# Altium schematic sheet DDR4.SchDoc: =ProjectTitle
size A3; Author: Jaime I. Chait; Organization: NWES LLC; Address1: 111 SW 5th Ave, STE 3150; Address2: Portland, OR 97204; SheetNumber: 12; SheetTotal: 19
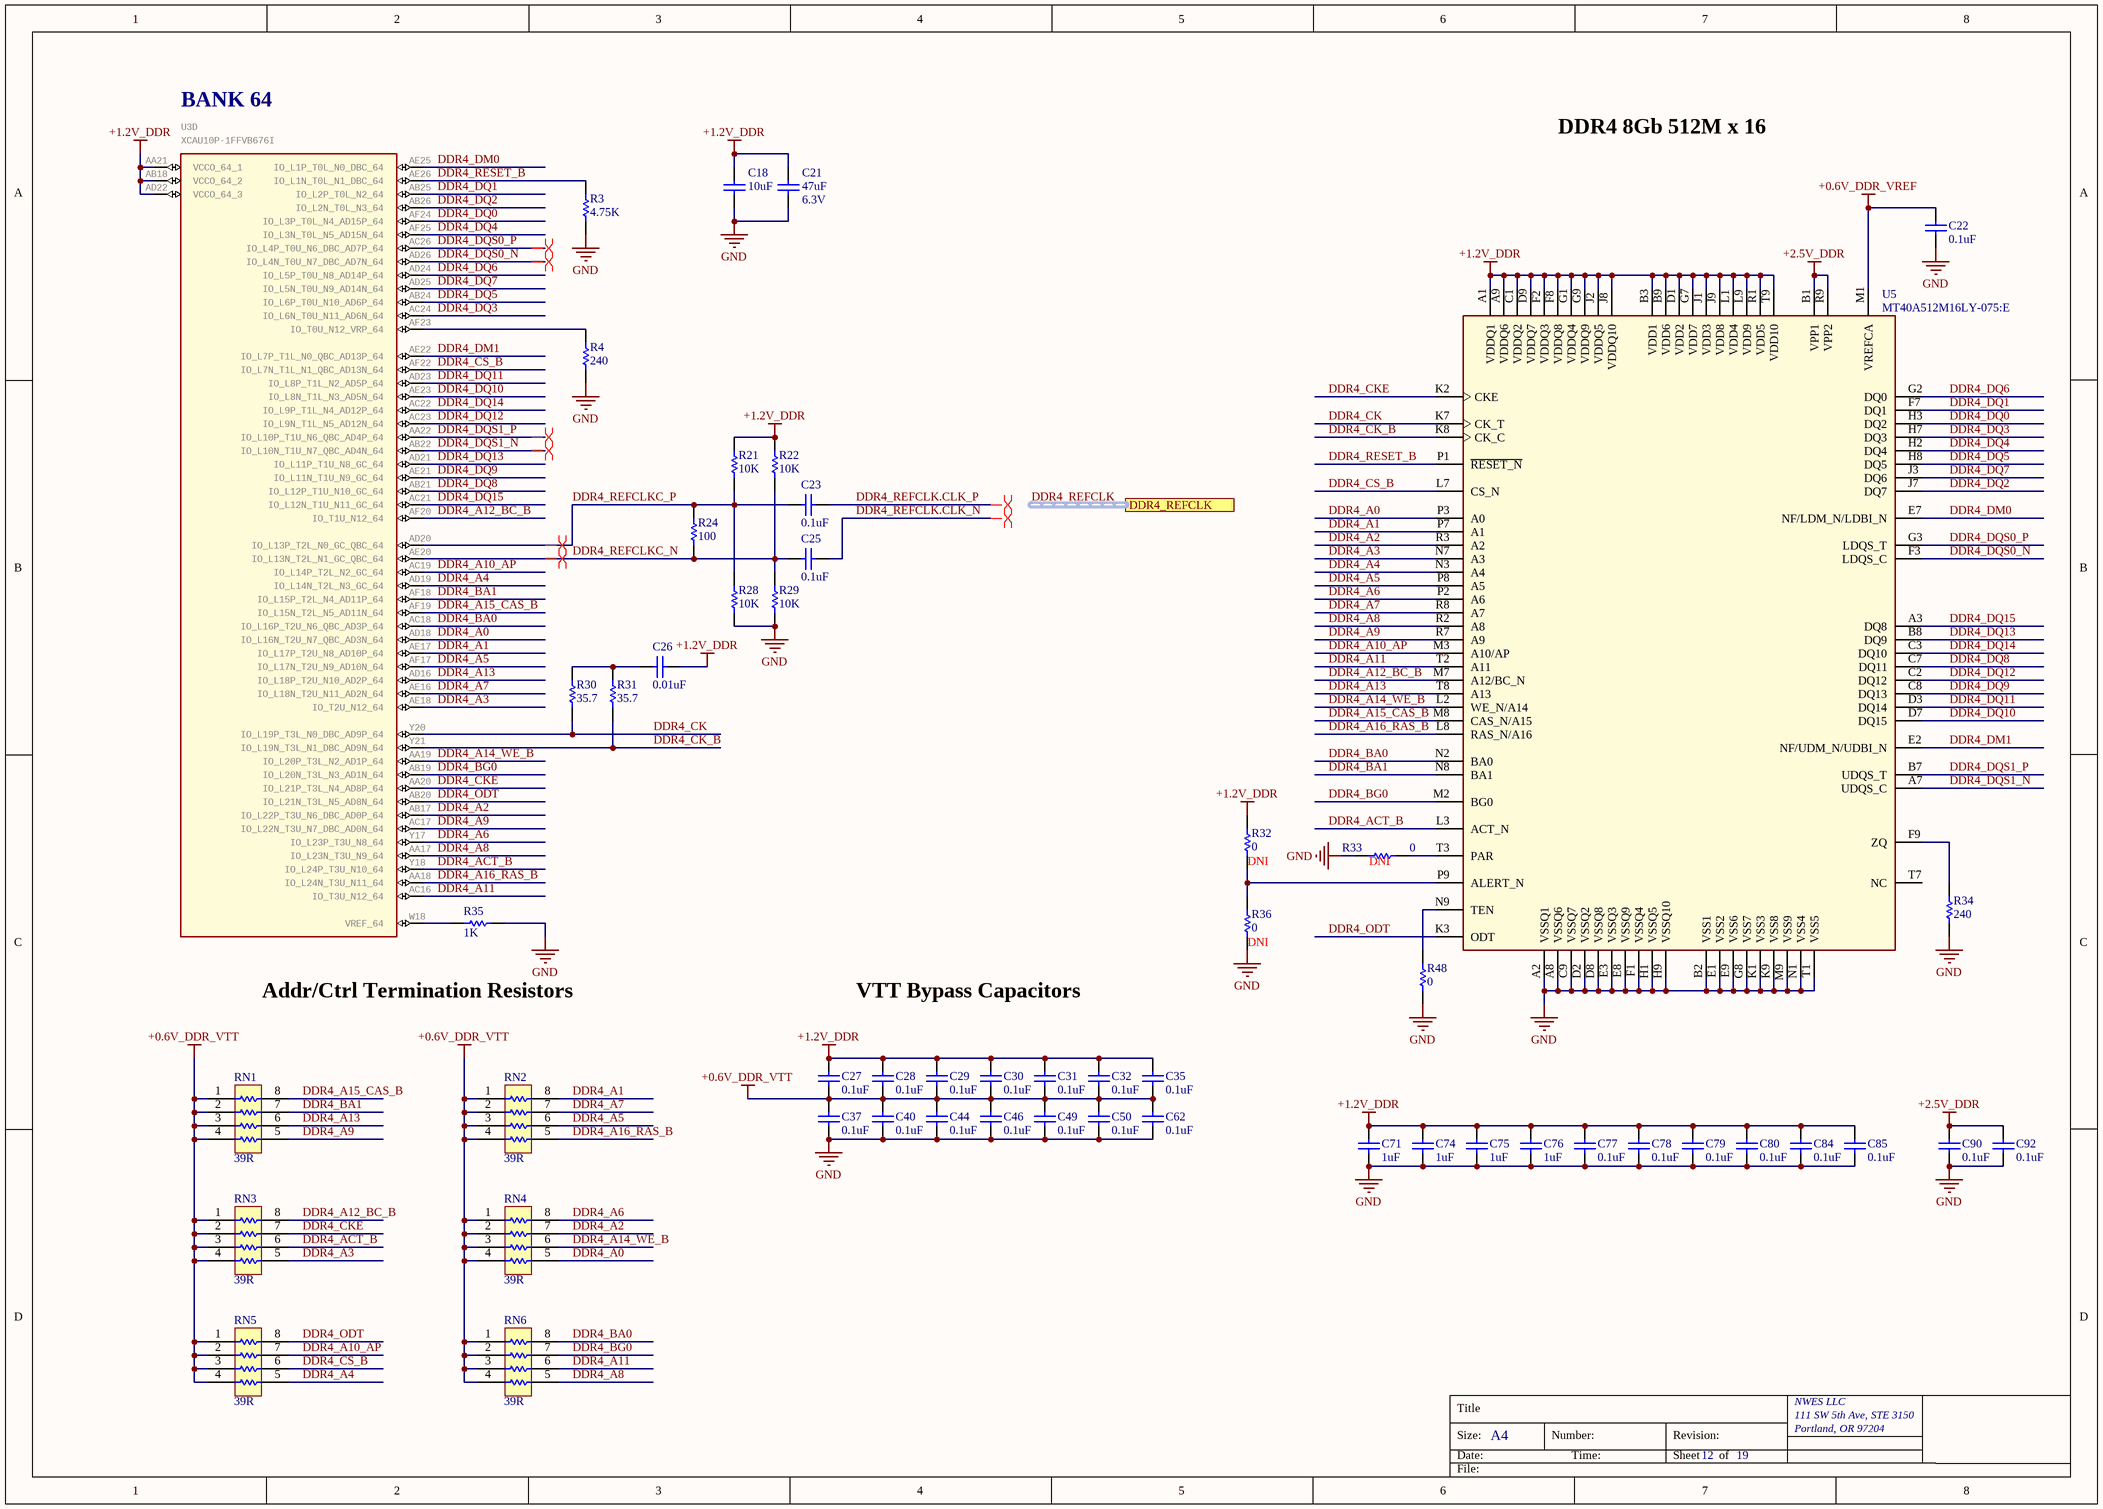
[diagram p0: DDR4.SchDoc]

## Parts
C18  10uF  [CAPC1005X90]
C21  47uF  Voltage Rating: 6.3V  [CAP-1206]
C22  0.1uF  [CAPC1005X55USR]
C23  0.1uF  [CAPC1005X55USR]
C25  0.1uF  [CAPC1005X55USR]
C26  0.01uF  [CAPC1005X55USR]
C27  0.1uF  [CAPC1005X55USR]
C28  0.1uF  [CAPC1005X55USR]
C29  0.1uF  [CAPC1005X55USR]
C30  0.1uF  [CAPC1005X55USR]
C31  0.1uF  [CAPC1005X55USR]
C32  0.1uF  [CAPC1005X55USR]
C35  0.1uF  [CAPC1005X55USR]
C37  0.1uF  [CAPC1005X55USR]
C40  0.1uF  [CAPC1005X55USR]
C44  0.1uF  [CAPC1005X55USR]
C46  0.1uF  [CAPC1005X55USR]
C49  0.1uF  [CAPC1005X55USR]
C50  0.1uF  [CAPC1005X55USR]
C62  0.1uF  [CAPC1005X55USR]
C71  1uF  [CAPC1005X55USR]
C74  1uF  [CAPC1005X55USR]
C75  1uF  [CAPC1005X55USR]
C76  1uF  [CAPC1005X55USR]
C77  0.1uF  [CAPC1005X55USR]
C78  0.1uF  [CAPC1005X55USR]
C79  0.1uF  [CAPC1005X55USR]
C80  0.1uF  [CAPC1005X55USR]
C84  0.1uF  [CAPC1005X55USR]
C85  0.1uF  [CAPC1005X55USR]
C90  0.1uF  [CAPC1005X55USR]
C92  0.1uF  [CAPC1005X55USR]
R3  4.75K  [RESC1005X40USR]
R4  240  [RESC1005X40USR]
R21  10K  [RESC1005X40USR]
R22  10K  [RESC1005X40USR]
R24  100  [RESC1005X40USR]
R28  10K  [RESC1005X40USR]
R29  10K  [RESC1005X40USR]
R30  35.7  [RESC1005X40USR]
R31  35.7  [RESC1005X40USR]
R32  0  [RESC1005X40USR]
R33  0  [RESC1005X40USR]
R34  240  [RESC1005X40USR]
R35  1K  [RESC1005X40USR]
R36  0  [RESC1005X40USR]
R48  0  [RESC1005X40USR]
RN1  39R  [RESCAXS50P100X200X45-8NA]
RN2  39R  [RESCAXS50P100X200X45-8NA]
RN3  39R  [RESCAXS50P100X200X45-8NA]
RN4  39R  [RESCAXS50P100X200X45-8NA]
RN5  39R  [RESCAXS50P100X200X45-8NA]
RN6  39R  [RESCAXS50P100X200X45-8NA]
U3  XCAU10P-1FFVB676I  [676-FCBGA (27x27)]  (part D of 16)
U5  MT40A512M16LY-075:E  [BGA96C80P6X16_1350X750X110]

## Ports
DDR4_REFCLK (harness DIFF_CLK)

## Nets
+0.6V_DDR_VREF: C22.2 U5.M1(VREFCA)
+0.6V_DDR_VTT: C27.1 C28.1 C29.1 C30.1 C31.1 C32.1 C35.1 C37.2 C40.2 C44.2 C46.2 C49.2 C50.2 C62.2 RN1.1 RN1.2 RN1.3 RN1.4 RN2.1 RN2.2 RN2.3 RN2.4 RN3.1 RN3.2 RN3.3 RN3.4 RN4.1 RN4.2 RN4.3 RN4.4 RN5.1 RN5.2 RN5.3 RN5.4 RN6.1 RN6.2 RN6.3 RN6.4
+1.2V_DDR: C18.2 C21.1 C26.2 C27.2 C28.2 C29.2 C30.2 C31.2 C32.2 C35.2 C71.2 C74.2 C75.2 C76.2 C77.2 C78.2 C79.2 C80.2 C84.2 C85.2 R21.2 R22.2 R32.1 U3.AA21(VCCO_64_1) U3.AB18(VCCO_64_2) U3.AD22(VCCO_64_3) U5.A1(VDDQ1) U5.A9(VDDQ6) U5.B3(VDD1) U5.B9(VDD6) U5.C1(VDDQ2) U5.D1(VDD2) U5.D9(VDDQ7) U5.F2(VDDQ3) U5.F8(VDDQ8) U5.G1(VDDQ4) U5.G7(VDD7) U5.G9(VDDQ9) U5.J1(VDD3) U5.J2(VDDQ5) U5.J8(VDDQ10) U5.J9(VDD8) U5.L1(VDD4) U5.L9(VDD9) U5.R1(VDD5) U5.T9(VDD10)
+2.5V_DDR: C90.2 C92.2 U5.B1(VPP1) U5.R9(VPP2)
GND: C18.1 C21.2 C22.1 C37.1 C40.1 C44.1 C46.1 C49.1 C50.1 C62.1 C71.1 C74.1 C75.1 C76.1 C77.1 C78.1 C79.1 C80.1 C84.1 C85.1 C90.1 C92.1 R3.1 R4.1 R28.1 R29.1 R33.2 R34.1 R35.2 R36.2 R48.1 U5.A2(VSSQ1) U5.A8(VSSQ6) U5.B2(VSS1) U5.C9(VSSQ7) U5.D2(VSSQ2) U5.D8(VSSQ8) U5.E1(VSS2) U5.E3(VSSQ3) U5.E8(VSSQ9) U5.E9(VSS6) U5.F1(VSSQ4) U5.G8(VSS7) U5.H1(VSSQ5) U5.H9(VSSQ10) U5.K1(VSS3) U5.K9(VSS8) U5.M9(VSS9) U5.N1(VSS4) U5.T1(VSS5)
DDR4_A0: RN4.5 U3.AD18(IO_L16N_T2U_N7_QBC_AD3N_64) U5.P3(A0)
DDR4_A1: RN2.8 U3.AE17(IO_L17P_T2U_N8_AD10P_64) U5.P7(A1)
DDR4_A2: RN4.7 U3.AB17(IO_L22P_T3U_N6_DBC_AD0P_64) U5.R3(A2)
DDR4_A3: RN3.5 U3.AE18(IO_T2U_N12_64) U5.N7(A3)
DDR4_A4: RN5.5 U3.AD19(IO_L14N_T2L_N3_GC_64) U5.N3(A4)
DDR4_A5: RN2.6 U3.AF17(IO_L17N_T2U_N9_AD10N_64) U5.P8(A5)
DDR4_A6: RN4.8 U3.Y17(IO_L23P_T3U_N8_64) U5.P2(A6)
DDR4_A7: RN2.7 U3.AE16(IO_L18N_T2U_N11_AD2N_64) U5.R8(A7)
DDR4_A8: RN6.5 U3.AA17(IO_L23N_T3U_N9_64) U5.R2(A8)
DDR4_A9: RN1.5 U3.AC17(IO_L22N_T3U_N7_DBC_AD0N_64) U5.R7(A9)
DDR4_A10_AP: RN5.7 U3.AC19(IO_L14P_T2L_N2_GC_64) U5.M3(A10/AP)
DDR4_A11: RN6.6 U3.AC16(IO_T3U_N12_64) U5.T2(A11)
DDR4_A12_BC_B: RN3.8 U3.AF20(IO_T1U_N12_64) U5.M7(A12/BC_N)
DDR4_A13: RN1.6 U3.AD16(IO_L18P_T2U_N10_AD2P_64) U5.T8(A13)
DDR4_A14_WE_B: RN4.6 U3.AA19(IO_L20P_T3L_N2_AD1P_64) U5.L2(WE_N/A14)
DDR4_A15_CAS_B: RN1.8 U3.AF19(IO_L15N_T2L_N5_AD11N_64) U5.M8(CAS_N/A15)
DDR4_A16_RAS_B: RN2.5 U3.AA18(IO_L24N_T3U_N11_64) U5.L8(RAS_N/A16)
DDR4_ACT_B: RN3.6 U3.Y18(IO_L24P_T3U_N10_64) U5.L3(ACT_N)
DDR4_BA0: RN6.8 U3.AC18(IO_L16P_T2U_N6_QBC_AD3P_64) U5.N2(BA0)
DDR4_BA1: RN1.7 U3.AF18(IO_L15P_T2L_N4_AD11P_64) U5.N8(BA1)
DDR4_BG0: RN6.7 U3.AB19(IO_L20N_T3L_N3_AD1N_64) U5.M2(BG0)
DDR4_CK: R30.1 U3.Y20(IO_L19P_T3L_N0_DBC_AD9P_64) U5.K7(CK_T)
DDR4_CK_B: R31.1 U3.Y21(IO_L19N_T3L_N1_DBC_AD9N_64) U5.K8(CK_C)
DDR4_CKE: RN3.7 U3.AA20(IO_L21P_T3L_N4_AD8P_64) U5.K2(CKE)
DDR4_CS_B: RN5.6 U3.AF22(IO_L7N_T1L_N1_QBC_AD13N_64) U5.L7(CS_N)
DDR4_DM0: U3.AE25(IO_L1P_T0L_N0_DBC_64) U5.E7(NF/LDM_N/LDBI_N)
DDR4_DM1: U3.AE22(IO_L7P_T1L_N0_QBC_AD13P_64) U5.E2(NF/UDM_N/UDBI_N)
DDR4_DQ0: U3.AF24(IO_L3P_T0L_N4_AD15P_64) U5.H3(DQ2)
DDR4_DQ1: U3.AB25(IO_L2P_T0L_N2_64) U5.F7(DQ1)
DDR4_DQ2: U3.AB26(IO_L2N_T0L_N3_64) U5.J7(DQ7)
DDR4_DQ3: U3.AC24(IO_L6N_T0U_N11_AD6N_64) U5.H7(DQ3)
DDR4_DQ4: U3.AF25(IO_L3N_T0L_N5_AD15N_64) U5.H2(DQ4)
DDR4_DQ5: U3.AB24(IO_L6P_T0U_N10_AD6P_64) U5.H8(DQ5)
DDR4_DQ6: U3.AD24(IO_L5P_T0U_N8_AD14P_64) U5.G2(DQ0)
DDR4_DQ7: U3.AD25(IO_L5N_T0U_N9_AD14N_64) U5.J3(DQ6)
DDR4_DQ8: U3.AB21(IO_L12P_T1U_N10_GC_64) U5.C7(DQ11)
DDR4_DQ9: U3.AE21(IO_L11N_T1U_N9_GC_64) U5.C8(DQ13)
DDR4_DQ10: U3.AE23(IO_L8N_T1L_N3_AD5N_64) U5.D7(DQ15)
DDR4_DQ11: U3.AD23(IO_L8P_T1L_N2_AD5P_64) U5.D3(DQ14)
DDR4_DQ12: U3.AC23(IO_L9N_T1L_N5_AD12N_64) U5.C2(DQ12)
DDR4_DQ13: U3.AD21(IO_L11P_T1U_N8_GC_64) U5.B8(DQ9)
DDR4_DQ14: U3.AC22(IO_L9P_T1L_N4_AD12P_64) U5.C3(DQ10)
DDR4_DQ15: U3.AC21(IO_L12N_T1U_N11_GC_64) U5.A3(DQ8)
DDR4_DQS0_N: U3.AD26(IO_L4N_T0U_N7_DBC_AD7N_64) U5.F3(LDQS_C)
DDR4_DQS0_P: U3.AC26(IO_L4P_T0U_N6_DBC_AD7P_64) U5.G3(LDQS_T)
DDR4_DQS1_N: U3.AB22(IO_L10N_T1U_N7_QBC_AD4N_64) U5.A7(UDQS_C)
DDR4_DQS1_P: U3.AA22(IO_L10P_T1U_N6_QBC_AD4P_64) U5.B7(UDQS_T)
DDR4_ODT: RN5.8 U3.AB20(IO_L21N_T3L_N5_AD8N_64) U5.K3(ODT)
DDR4_REFCLK.CLK_N: C25.1
DDR4_REFCLK.CLK_P: C23.1
DDR4_REFCLKC_N: C25.2 R22.1 R24.1 R29.2 U3.AE20(IO_L13N_T2L_N1_GC_QBC_64)
DDR4_REFCLKC_P: C23.2 R21.1 R24.2 R28.2 U3.AD20(IO_L13P_T2L_N0_GC_QBC_64)
DDR4_RESET_B: R3.2 U3.AE26(IO_L1N_T0L_N1_DBC_64) U5.P1(~{RESET_N})
NetC26_1: C26.1 R30.2 R31.2
NetR4_2: R4.2 U3.AF23(IO_T0U_N12_VRP_64)
NetR32_2: R32.2 R36.1 U5.P9(ALERT_N)
NetR33_1: R33.1 U5.T3(PAR)
NetR34_2: R34.2 U5.F9(ZQ)
NetR35_1: R35.1 U3.W18(VREF_64)
NetR48_2: R48.2 U5.N9(TEN)

Not connected (* = marked no-connect by the designer): U5 T7(NC)

## Buses and harness runs
harness DDR4_REFCLK = port DDR4_REFCLK

## Layout directives
differential pair: DDR4_DQS0_N, DDR4_DQS0_P, DDR4_DQS1_N, DDR4_DQS1_P, DDR4_REFCLK.CLK_N, DDR4_REFCLK.CLK_P, DDR4_REFCLKC_N, DDR4_REFCLKC_P

## Notes on the sheet
- DDR4 8Gb 512M x 16
- (near R32) DNI
- (near R33) DNI
- (near R36) DNI
- Addr/Ctrl Termination Resistors
- VTT Bypass Capacitors
- Title
- Size:
- Date:
- A4
- Number:
- Time:
- Revision:
- Sheet
- of
- File:
- (in symbol XCAU10P-1FFVB676I, part D) BANK 64

## Library data of the parts
C18 = CAP CER 10UF 10V X5R 0402: Manufacturer Part Number: CL05A106MP8NUB8; Manufacturer: Samsung Electro-Mechanics; Part #: E-CAP-042; Supplier Part Number 1: 1276-6830-2-ND; Package: 0402; value: 10uF; Supplier 1: Digi-Key; Height: 0.9mm; ComponentLink1Description: New link; ComponentLink1URL: *
C21 = CAP CER 47UF 6.3V X5R 0805: Manufacturer: Samsung; Manufacturer Part Number: CL21A476MQYNNNE; Tolerance: 20%; Supplier 1: Digi-Key; RoHS: Yes; Category: Ceramic Capacitors; Stock 1: 1673694; Pricing 1: 1=0.29000, 10=0.20200, 50=0.13440, 100=0.11420, 500=0.08064, 1000=0.07057 (USD); Mount: Surface Mount; Case/Package: 0805; Case Code (Metric): 2012; Case Code (Imperial): 0805; Contact Plating: Tin; Min Operating Temperature: -55°C; Max Operating Temperature: 85°C; Capacitance: 47uF; Package Quantity: 1; Packaging: Tape and Reel; Dielectric: X5R; Series: CL; Construction: Flat; Length: 2mm; Width: 0.049inch; Height: 1.25mm; Thickness: 0.057inch; Depth: 1.25mm; Radiation Hardening: No; RoHS Compliant: Yes; ComponentLink1URL: https://datasheet.ciiva.com/25791/cl21a476mqynnne-25791153.pdf?src-supplier=Digi-Key; ComponentLink1Description: https://datasheet.ciiva.com/25791/cl21a476mqynnne-25791153.pdf?src-supplier=Digi-Key; ComponentLink2URL: https://datasheet.ciiva.com/26838/getdatasheetpartid-359050-26838632.pdf?src-supplier=Verical; ComponentLink2Description: https://datasheet.ciiva.com/26838/getdatasheetpartid-359050-26838632.pdf?src-supplier=Verical; Supplier Part Number 1: 1276-1852-1-ND
C22 C23 C25 C27-C32 C35 C37 C40 C44 C46 C49 C50 C62 C77-C80 C84 C85 C90 C92 = CAP CER 0.1UF 25V X5R 0402: Manufacturer Part Number: CL05A104KA5NNNC; Manufacturer: Samsung Electro-Mechanics; Supplier Part Number 1: 1276-1043-1-ND; Package: 0402; Height: 0.55mm; Supplier 1: Digi-Key; value: 0.1uF
C26 = CAP CER 0.01uF 50V X7R 0402: CAP CER 10000PF 50V X7R 0402; Manufacturer Part Number: GCM155R71H103KA55D; Manufacturer: Murata Electronics; Supplier Part Number 1: 490-4762-1-ND; Package: 0402; Height: 0.55mm; Supplier 1: Digi-Key; value: 0.01uF
C71 C74-C76 = CAP CER 1UF 25V X5R 0402: Manufacturer Part Number: GRM155R61E105MA12D; Manufacturer: Murata Electronics; Part #: E-CAP-042; Supplier Part Number 1: 490-10018-1-ND; Package: 0402; value: 1uF; Supplier 1: Digi-Key; Height: 0.55mm; ComponentLink1Description: New link; ComponentLink1URL: *
R3 = RES 4.75K OHM 1% 1/16W 0402: Manufacturer: YAGEO; Manufacturer Part Number: RC0402FR-074K75L; Supplier Part Number 1: 311-4.75KLCT-ND; Supplier 1: Digi-Key; Height: 0.4mm; Package: 0402; value: 4.75K
R4 R34 = RES 240 OHM 1% 1/16W 0402: Manufacturer: YAGEO; Manufacturer Part Number: RC0402FR-07240RL; Supplier Part Number 1: 311-240LRCT-ND; Supplier 1: Digi-Key; Height: 0.4mm; Package: 0402; value: 240
R21 R22 R28 R29 = RES 10K OHM 1% 1/16W 0402: Manufacturer: YAGEO; Manufacturer Part Number: RC0402FR-0710KL; Supplier Part Number 1: 311-10.0KLRCT-ND; Package: 0402; Height: 0.4mm; Supplier 1: Digi-Key; value: 10K; Tolerance: ±1%
R24 = RES 100 OHM 1% 1/16W 0402: Manufacturer: YAGEO; Manufacturer Part Number: RC0402FR-07100RL; Supplier Part Number 1: 311-100LRCT-ND; Supplier 1: Digi-Key; Height: 0.4mm; Package: 0402; value: 100
R30 R31 = RES 35.7 OHM 1% 1/16W 0402: Manufacturer: YAGEO; Manufacturer Part Number: RC0402FR-0735R7L; Supplier Part Number 1: YAG3131CT-ND; Supplier 1: Digi-Key; Height: 0.4mm; Package: 0402; value: 35.7
R32 R33 R36 R48 = RES 0 OHM JUMPER 1/16W 0402: Manufacturer: Yageo; Manufacturer Part Number: RC0402JR-070RL; Supplier Part Number 1: 311-0.0JRTR-ND; Package: 0402; Height: 0.4mm; Supplier 1: Digi-Key; value: 0
R35 = RES 1K OHM 1% 1/16W 0402: Manufacturer: YAGEO; Manufacturer Part Number: RC0402FR-071KL; Supplier Part Number 1: 311-1.00KLRCT-ND; Supplier 1: Digi-Key; Height: 0.4mm; Package: 0402; value: 1K
RN1-RN6 = RES ARRAY 4 RES 39 OHM 0804: Res Thick Film Array 39 Ohm 5% ±200ppm/°C ISOL Molded 8-Pin 0804(4 X 0402) Concave SMD T/R; Manufacturer: Panasonic; Manufacturer Part Number: EXB-N8V390JX; Number of Terminals/Pins: 8; Voltage Rating: 50V; Circuit Type: Isolated; Number of Resistors: 4; Power Per Element: 31mW; Voltage Rating (DC): 100V; Supplier 1: Digi-Key; RoHS: Yes; Category: Resistor Arrays; Stock 1: 44825; Pricing 1: 1=0.22000, 10=0.18200, 25=0.13240, 50=0.09600, 100=0.07110, 250=0.05456, 500=0.04300, 1000=0.02977, 5000=0.02481 (USD); Mount: Surface Mount; Case/Package: 0804; Number of Pins: 8; Min Operating Temperature: -55°C; Max Operating Temperature: 125°C; Packaging: Tape and Reel; Resistance: 39R; Tolerance: 5%; Package Quantity: 1; Termination: Concave; Temperature Coefficient: 200ppm/°C; Number of Contacts: 8; Series: EXB; Technology: THICK FILM; Length: 2mm; Width: 0.039inch; Height: 0.45mm; Terminal Pitch: 0.5mm; Depth: 1mm; Radiation Hardening: No; Military Standard: Not; Lead Free: Contains Lead; RoHS Compliant: Yes; ComponentLink1URL: https://datasheet.ciiva.com/3876/41799912s9680473n1386-3876707.pdf?src-supplier=Arrow+Electronics; ComponentLink1Description: https://datasheet.ciiva.com/3876/41799912s9680473n1386-3876707.pdf?src-supplier=Arrow+Electronics; ComponentLink2URL: https://datasheet.ciiva.com/26944/getdatasheetpartid-253340-26944301.pdf?src-supplier=Verical; ComponentLink2Description: https://datasheet.ciiva.com/26944/getdatasheetpartid-253340-26944301.pdf?src-supplier=Verical; ComponentLink3URL: https://datasheet.ciiva.com/19466/1991221-19466954.pdf?src-supplier=Jameco; ComponentLink3Description: https://datasheet.ciiva.com/19466/1991221-19466954.pdf?src-supplier=Jameco; Supplier Part Number 1: Y10390CT-ND
U3 = XCAU10P-1FFVB676I: IC FPGA ARTIXUP 676BGA; Manufacturer: AMD Xilinx; Manufacturer Part Number: XCAU10P-1FFVB676I; Supplier Part Number 1: 122-XCAU10P-1FFVB676I-ND; Supplier 1: Supplier
U5 = MT40A512M16LY-075:E: DRAM Chip DDR4 SDRAM 8Gbit 512Mx16 1.2V 96-Pin FBGA Tray; MF: Micron Technology; Memory Type: Volatile; Memory Size: 8Gb; Frequency: 1.33GHz; MP: MT40A512M16LY-075:E; Package: TFBGA-96 Micron Technology; Price: None; Availability: Unavailable; SnapEDA_Link: https://www.snapeda.com/parts/MT40A512M16LY-075:E/Micron%20Technology%20Inc./view-part/1658163/?ref=snap; Value: *; Supplier 1: Newark; Manufacturer: Micron Technology; Manufacturer Part Number: MT40A512M16LY-075:E; RoHS: Yes; Category: RAM; Stock 1: 277; Pricing 1: 1=13.01000, 10=12.05000, 25=11.78000, 50=11.72000, 100=10.31000, 250=9.80000, 500=9.68000 (USD); Min Operating Temperature: 0°C; Max Operating Temperature: 95°C; RoHS Compliant: Yes; ComponentLink1URL: https://www.micron.com/~/media/documents/products/data-sheet/dram/ddr4/8gb_ddr4_sdram.pdf?src-supplier=Digi-Key; ComponentLink1Description: https://www.micron.com/~/media/documents/products/data-sheet/dram/ddr4/8gb_ddr4_sdram.pdf?src-supplier=Digi-Key; Supplier Part Number 1: 83AH2723